# EAGLE design zSum_4_io_board_rev_A (EAGLE 6.5.0)
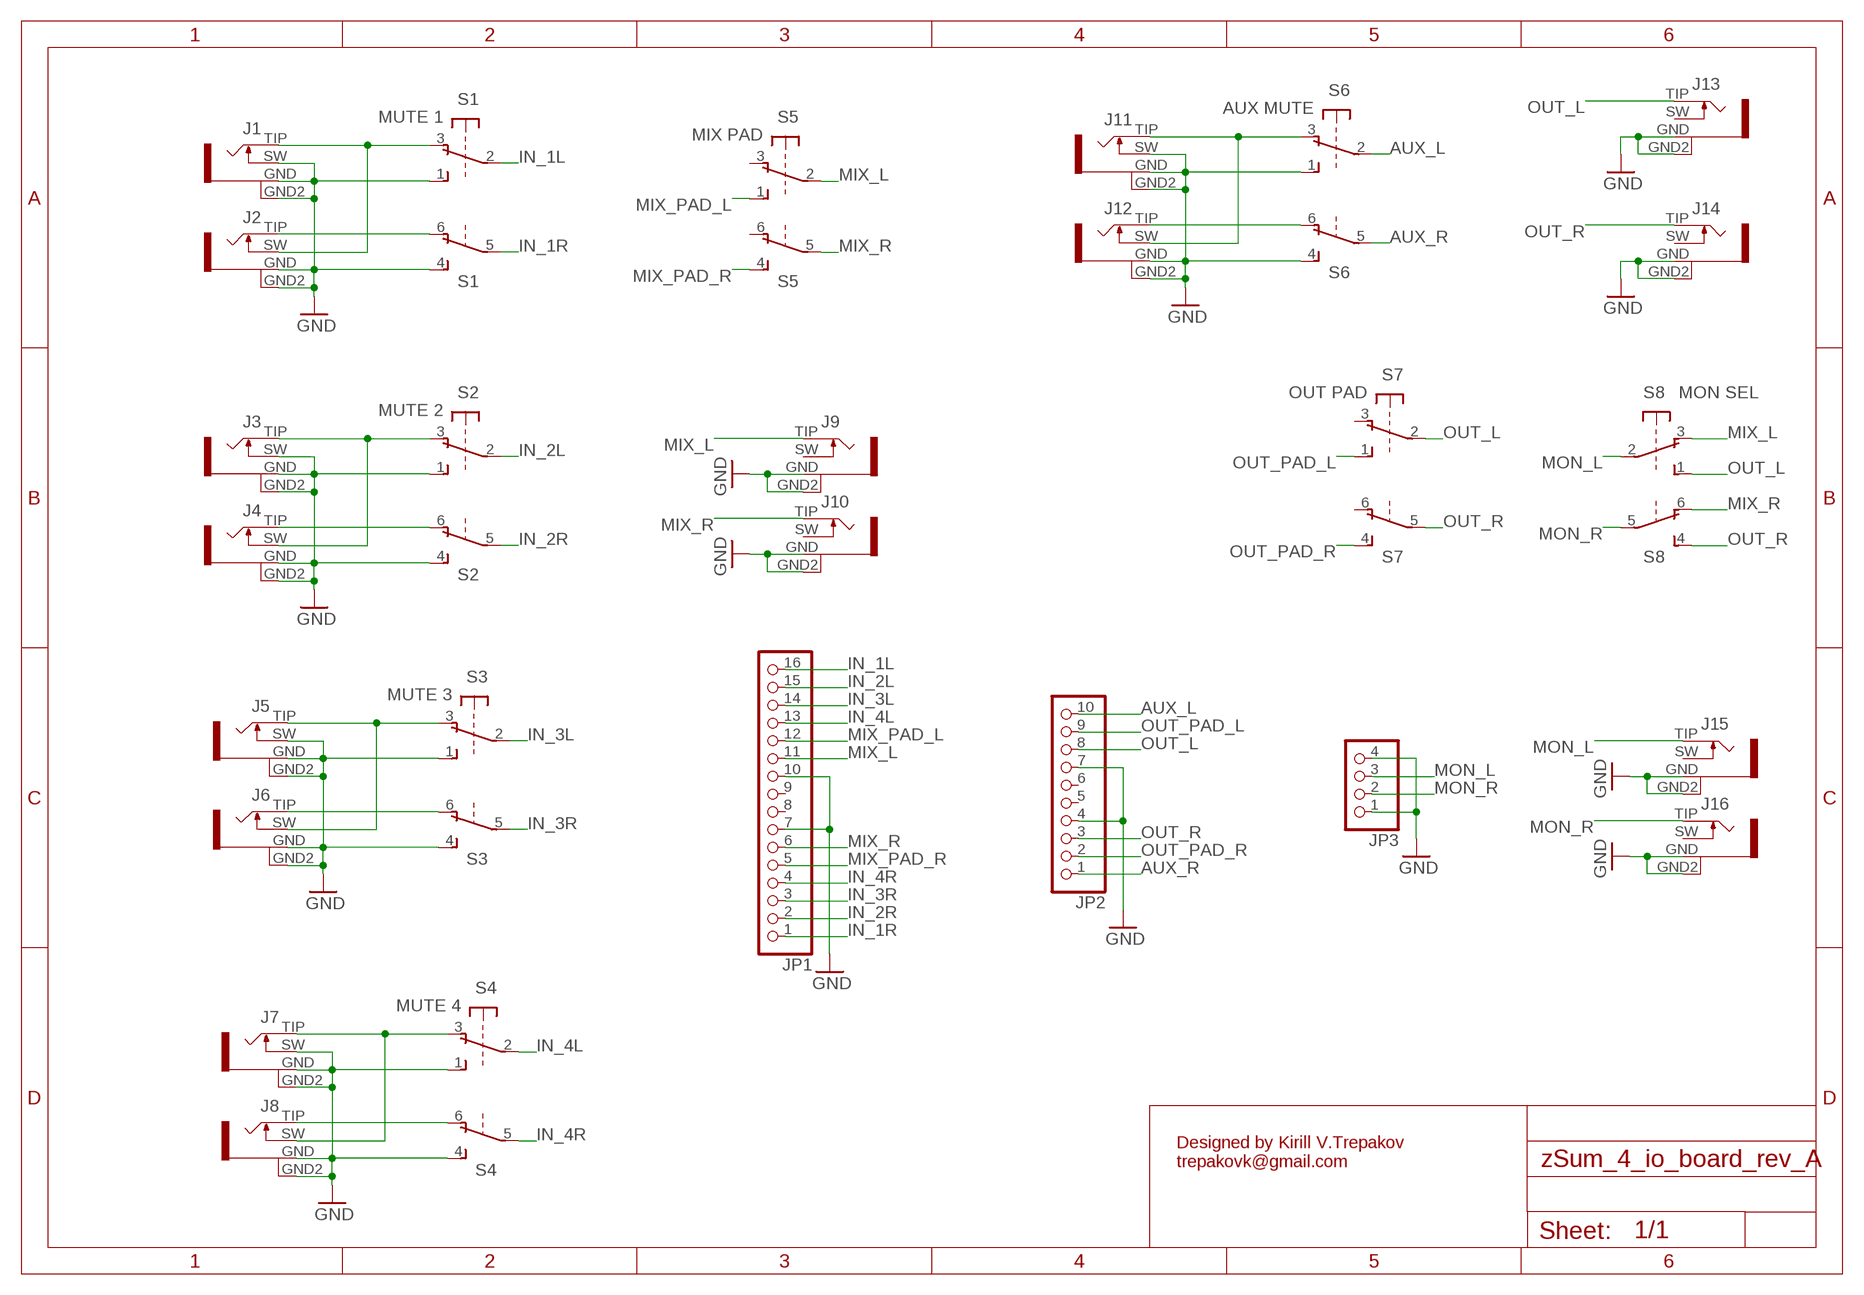
[diagram p0: schematic, sheet 1]

## Parts
J1  PJ301WQP  [WQP_PJ_301BM]
J2  PJ301WQP  [WQP_PJ_301BM]
J3  PJ301WQP  [WQP_PJ_301BM]
J4  PJ301WQP  [WQP_PJ_301BM]
J5  PJ301WQP  [WQP_PJ_301BM]
J6  PJ301WQP  [WQP_PJ_301BM]
J7  PJ301WQP  [WQP_PJ_301BM]
J8  PJ301WQP  [WQP_PJ_301BM]
J9  PJ301WQP  [WQP_PJ_301BM]
J10  PJ301WQP  [WQP_PJ_301BM]
J11  PJ301WQP  [WQP_PJ_301BM]
J12  PJ301WQP  [WQP_PJ_301BM]
J13  PJ301WQP  [WQP_PJ_301BM]
J14  PJ301WQP  [WQP_PJ_301BM]
J15  PJ301WQP  [WQP_PJ_301BM]
J16  PJ301WQP  [WQP_PJ_301BM]
JP1  PINHD-1X16  [1X16_]
JP2  PINHD-1X10  [1X10_]
JP3  PINHD-1X4  [1X04]
S1  MUTE 1  9077-2  [9077-2]
S2  MUTE 2  9077-2  [9077-2]
S3  MUTE 3  9077-2  [9077-2]
S4  MUTE 4  9077-2  [9077-2]
S5  MIX PAD  9077-2  [9077-2]
S6  AUX MUTE  9077-2  [9077-2]
S7  OUT PAD  9077-2  [9077-2]
S8  MON SEL  9077-2  [9077-2]

## Nets
AUX_L: JP2.10 S6.2(1:P)
AUX_R: JP2.1 S6.5(2:P)
GND: J1.GND J1.GND2 J1.SW J2.GND J2.GND2 J3.GND J3.GND2 J3.SW J4.GND J4.GND2 J5.GND J5.GND2 J5.SW J6.GND J6.GND2 J7.GND J7.GND2 J7.SW J8.GND J8.GND2 J9.GND J9.GND2 J10.GND J10.GND2 J11.GND J11.GND2 J11.SW J12.GND J12.GND2 J13.GND J13.GND2 J14.GND J14.GND2 J15.GND J15.GND2 J16.GND J16.GND2 JP1.7 JP1.10 JP2.4 JP2.7 JP3.1 JP3.4 S1.1(1:S) S1.4(2:S) S2.1(1:S) S2.4(2:S) S3.1(1:S) S3.4(2:S) S4.1(1:S) S4.4(2:S) S6.1(1:S) S6.4(2:S)
IN_1L: JP1.16 S1.2(1:P)
IN_1R: JP1.1 S1.5(2:P)
IN_2L: JP1.15 S2.2(1:P)
IN_2R: JP1.2 S2.5(2:P)
IN_3L: JP1.14 S3.2(1:P)
IN_3R: JP1.3 S3.5(2:P)
IN_4L: JP1.13 S4.2(1:P)
IN_4R: JP1.4 S4.5(2:P)
MIX_L: J9.TIP JP1.11 S5.2(1:P) S8.3(1:O)
MIX_PAD_L: JP1.12 S5.1(1:S)
MIX_PAD_R: JP1.5 S5.4(2:S)
MIX_R: J10.TIP JP1.6 S5.5(2:P) S8.6(2:O)
MON_L: J15.TIP JP3.3 S8.2(1:P)
MON_R: J16.TIP JP3.2 S8.5(2:P)
N$1: J1.TIP J2.SW S1.3(1:O)
N$5: J3.TIP J4.SW S2.3(1:O)
N$6: J2.TIP S1.6(2:O)
N$7: J4.TIP S2.6(2:O)
N$8: J5.TIP J6.SW S3.3(1:O)
N$9: J6.TIP S3.6(2:O)
N$10: J7.TIP J8.SW S4.3(1:O)
N$11: J8.TIP S4.6(2:O)
N$12: J11.TIP J12.SW S6.3(1:O)
N$13: J12.TIP S6.6(2:O)
OUT_L: J13.TIP JP2.8 S7.2(1:P) S8.1(1:S)
OUT_PAD_L: JP2.9 S7.1(1:S)
OUT_PAD_R: JP2.2 S7.4(2:S)
OUT_R: J14.TIP JP2.3 S7.5(2:P) S8.4(2:S)
Unconnected: J9.SW J10.SW J13.SW J14.SW J15.SW J16.SW JP1.8 JP1.9 JP2.5 JP2.6 S5.3(1:O) S5.6(2:O) S7.3(1:O) S7.6(2:O)

## Notes on the sheet
- Designed by Kirill V.Trepakov
  trepakovk@gmail.com

## Library data of the parts
J1-J16 = og-pj301:PJ301
JP1 = _mtvl.connectors:PINHD-1X16: PIN HEADER
JP2 = _mtvl.connectors:PINHD-1X10: PIN HEADER
JP3 = _mtvl.connectors:PINHD-1X4: PIN HEADER
S1-S8 = _zEROID:9077-2: MARQUARDT SWITCH 9077.0200 Distributor: Buerklin <https://www.buerklin.com/default.asp?event=ShowArtikel%2812G2822%29&l=d&jump=ArtNr_12G2822>

## Board
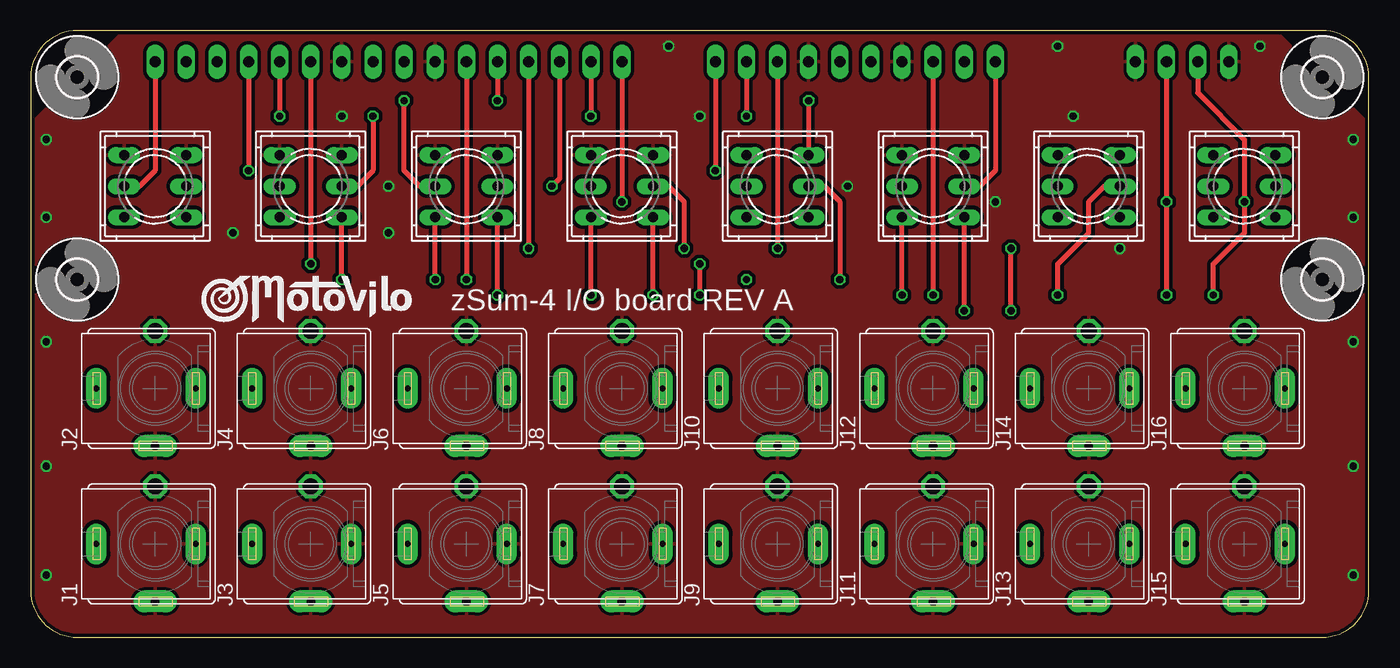
[diagram p1: board, top side]
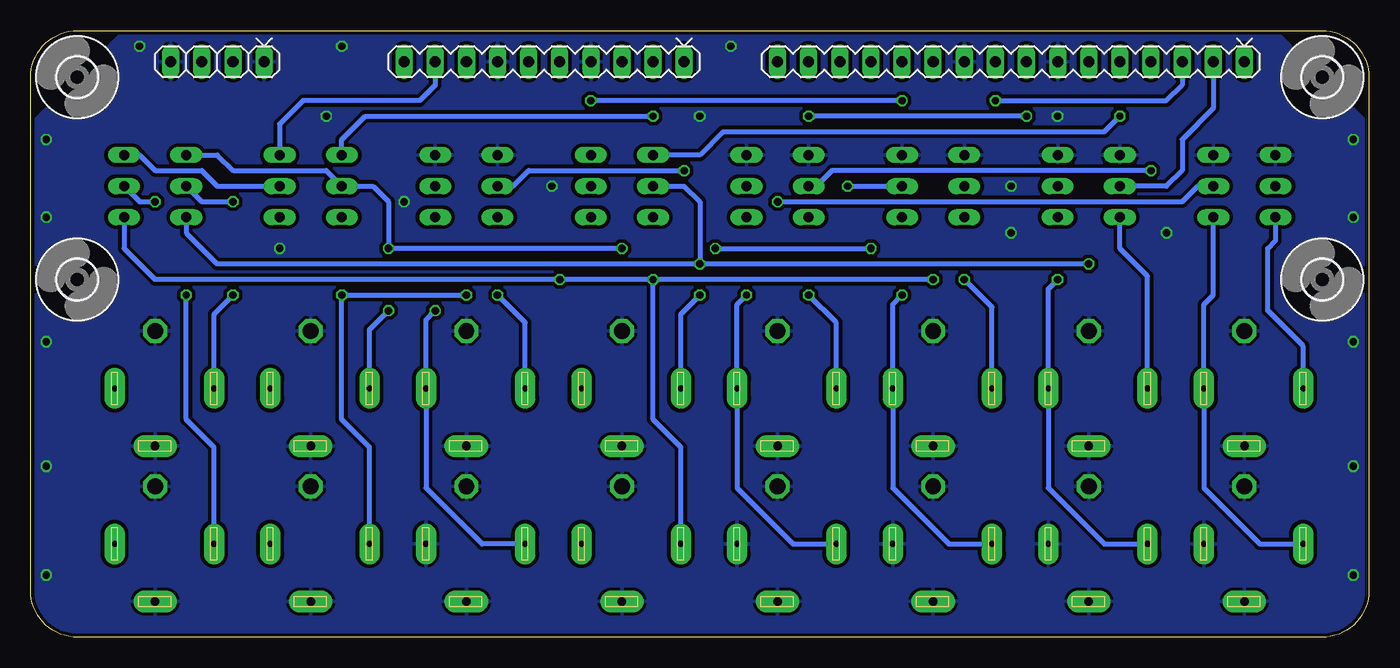
[diagram p2: board, bottom side, seen from below]

Size 109.22 x 49.53 mm. Coordinates in mm from the lower left corner, seen from the top.
Outline: 3.81,0 105.41,0 arc90 109.22,3.81 109.22,45.72 arc90 105.41,49.53 3.81,49.53 arc90 0,45.72 0,3.81 arc90 3.81,0
Copper layers (1*16): Top 0.035mm / dielectric 1.5mm / Bottom 0.035mm
Design rules "ITEADstudio_DRC_z": minimum track width 10mil, minimum drill 12mil, track to track 10mil, track to pad 10mil, pad to pad 10mil, via to via 10mil, smd to smd 8mil, copper to edge 10mil, drill to drill 25mil, minimum pad ring 10mil, minimum via ring 6mil, stop-mask expansion 2mil, vias tented up to drill 100mil, thermal gap 10mil

### Footprints (pad centres in the part's own frame; a part is rotated, then mirrored left to right if it is on the bottom)
WQP_PJ_301BM = drill 0.7 pad 1.778 long: GND -4.7,0 | drill 1.3 octagon: GND2 4.7,0 | drill 0.5 pad 1.676 long: SW 0,-3.3; TIP 0,4.8
1X16_ = drill 0.9 long: 1 -19.05,0; 2 -16.51,0; 3 -13.97,0; 4 -11.43,0; 5 -8.89,0; 6 -6.35,0; 7 -3.81,0; 8 -1.27,0; 9 1.27,0; 10 3.81,0; 11 6.35,0; 12 8.89,0; 13 11.43,0; 14 13.97,0; 15 16.51,0; 16 19.05,0
1X10_ = drill 0.9 long: 1 -11.43,0; 2 -8.89,0; 3 -6.35,0; 4 -3.81,0; 5 -1.27,0; 6 1.27,0; 7 3.81,0; 8 6.35,0; 9 8.89,0; 10 11.43,0
1X04 = drill 0.9 long: 1 -3.81,0; 2 -1.27,0; 3 1.27,0; 4 3.81,0
9077-2 = drill 0.813 long: 1 -2.54,2.54; 2 0,2.54; 3 2.54,2.54; 4 -2.54,-2.54; 5 0,-2.54; 6 2.54,-2.54
3,2_NEW = hole 3.2: 0,0

### Placement (x,y rotation side)
J1  10.16,7.62 90 top
J2  10.16,20.32 90 top
J3  22.86,7.62 90 top
J4  22.86,20.32 90 top
J5  35.56,7.62 90 top
J6  35.56,20.32 90 top
J7  48.26,7.62 90 top
J8  48.26,20.32 90 top
J9  60.96,7.62 90 top
J10  60.96,20.32 90 top
J11  73.66,7.62 90 top
J12  73.66,20.32 90 top
J13  86.36,7.62 90 top
J14  86.36,20.32 90 top
J15  99.06,7.62 90 top
J16  99.06,20.32 90 top
JP1  29.21,46.99 180 bottom
JP2  67.31,46.99 180 bottom
JP3  93.98,46.99 180 bottom
S1  10.16,36.83 270 top
S2  22.86,36.83 270 top
S3  35.56,36.83 270 top
S4  48.26,36.83 270 top
S5  60.96,36.83 270 top
S6  73.66,36.83 270 top
S7  86.36,36.83 270 top
S8  99.06,36.83 270 top
U$1  [3,2_NEW]  3.81,45.72 0 top
U$2  [3,2_NEW]  105.41,45.72 0 top
U$3  [3,2_NEW]  3.81,29.21 0 top
U$4  [3,2_NEW]  105.41,29.21 0 top
U$6  [LOGO_SPACE_002]  13.97,25.72 0 top

### Tracks (layer width: path | path; a pad name or v marks a point on that pad's centre or on a via)
AUX_L
  Top 0.406: JP2.10 78.74,38.1 77.47,36.83 S6.2
AUX_R  (via drill 0.6)
  Top 0.406: JP2.1 v55.88,38.1
  Bottom 0.406: S6.5 69.85,36.83 68.58,38.1 v55.88,38.1
GND  (via drill 0.6)
  other vias: 107.95,40.64 107.95,34.29 1.27,40.64 1.27,34.29 29.21,33.02 52.07,48.26 83.82,48.26 1.27,24.13 107.95,24.13 1.27,13.97 1.27,5.08 107.95,13.97 107.95,5.08 100.33,48.26 16.51,33.02 66.67,36.83 78.74,35.56 85.09,42.55 54.61,42.55 25.4,42.55 29.21,36.83 88.9,31.75
  pour Top (isolate 0.305): 0,41.91 7.62,49.53 101.6,49.53 109.22,41.91 109.22,0 0,0
  pour Bottom (isolate 0.305): 0,0 0,41.91 7.62,49.53 101.6,49.53 109.22,41.91 109.22,0
IN_1L  (via drill 0.6)
  Top 0.406: JP1.16 v48.26,35.56
  Bottom 0.406: v48.26,35.56 15.24,35.56 13.97,36.83 S1.2
IN_1R
  Top 0.406: S1.5 8.89,36.83 10.16,38.1 JP1.1
IN_2L  (via drill 0.6)
  Top 0.406: v27.94,42.55 27.94,38.1 26.67,36.83 S2.2 | JP1.15 v45.72,42.55
  Bottom 0.406: v27.94,42.55 v45.72,42.55
IN_2R
  Bottom 0.406: JP1.2 12.7,43.18 15.24,40.64 15.24,38.1 16.51,36.83 S2.5
IN_3L  (via drill 0.6)
  Top 0.406: JP1.14 43.18,37.47 v42.55,36.83
  Bottom 0.406: v42.55,36.83 S3.2
IN_3R  (via drill 0.6)
  Top 0.406: S3.5 31.75,36.83 30.48,38.1 v30.48,43.81
  Bottom 0.406: v30.48,43.81 16.51,43.81 15.24,45.09 JP1.3
IN_4L  (via drill 0.6)
  Top 0.406: v53.34,31.75 53.34,35.56 52.07,36.83 S4.2 | JP1.13 v40.64,31.75
  Bottom 0.406: v53.34,31.75 v40.64,31.75
IN_4R  (via drill 0.6)
  Top 0.406: JP1.4 v17.78,38.1
  Bottom 0.406: v17.78,38.1 43.81,38.1 45.09,36.83 S4.5
MIX_L  (via drill 0.6)
  Top 0.406: S5.2 64.77,36.83 66.04,35.56 v66.04,29.21 | JP1.11 v35.56,29.21
  Bottom 0.406: v35.56,29.21 v58.42,29.21 | v58.42,29.21 v66.04,29.21 99.06,29.21 101.6,31.75 S8.3 | v58.42,29.21 58.42,17.78 56.16,15.52 J9.TIP
MIX_PAD_L  (via drill 0.6)
  Top 0.406: JP1.12 v38.1,43.81 | v63.5,43.81 S5.1
  Bottom 0.406: v38.1,43.81 v63.5,43.81
MIX_PAD_R  (via drill 0.6)
  Top 0.406: JP1.5 v20.32,42.55
  Bottom 0.406: S5.4 54.61,39.37 52.7,41.27 21.59,41.27 v20.32,42.55
MIX_R  (via drill 0.6)
  Top 0.406: JP1.6 v22.86,30.48 | v54.61,27.94 v54.61,30.48
  Bottom 0.406: v22.86,30.48 v54.61,30.48 | v54.61,30.48 93.98,30.48 96.52,33.02 S8.6 | S5.5 55.88,36.83 54.61,35.56 v54.61,30.48 | J10.TIP 56.16,26.39 v54.61,27.94
MON_L  (via drill 0.6)
  Top 0.406: v96.52,27.94 96.52,30.48 99.06,33.02 v99.06,35.56 99.06,40.64 95.25,44.45 JP3.3
  Bottom 0.406: J15.TIP 94.26,15.52 96.52,17.78 v96.52,27.94 | S8.2 100.33,35.56 v99.06,35.56
MON_R  (via drill 0.6)
  Top 0.406: JP3.2 v92.71,35.56 v92.71,27.94
  Bottom 0.406: S8.5 95.25,35.56 v92.71,35.56 | J16.TIP 94.26,26.39 v92.71,27.94
N$1
  Bottom 0.406: S1.3 12.7,27.94 13.46,27.18 J2.SW 13.46,12.19 8.89,7.62 J1.TIP
N$5  (via drill 0.6)
  Top 0.406: v25.4,29.21 S2.3
  Bottom 0.406: J3.TIP 21.59,7.62 26.16,12.19 J4.SW 26.16,28.45 v25.4,29.21
N$6
  Bottom 0.406: S1.6 7.62,32.38 8.26,31.75 8.26,26.67 5.36,23.77 J2.TIP
N$7
  Bottom 0.406: J4.TIP 18.06,29.49 20.32,31.75 S2.6
N$8  (via drill 0.6)
  Top 0.406: v38.1,27.94 S3.3
  Bottom 0.406: J5.TIP 34.29,7.62 38.86,12.19 J6.SW 38.86,27.18 v38.1,27.94
N$9  (via drill 0.6)
  Top 0.406: v33.02,29.21 S3.6
  Bottom 0.406: J6.TIP 30.76,26.95 v33.02,29.21
N$10  (via drill 0.6)
  Top 0.406: v50.8,27.94 S4.3
  Bottom 0.406: J7.TIP 46.99,7.62 51.56,12.19 J8.SW 51.56,27.18 v50.8,27.94
N$11  (via drill 0.6)
  Top 0.406: v45.72,27.94 S4.6
  Bottom 0.406: J8.TIP 43.46,25.68 v45.72,27.94
N$12  (via drill 0.6)
  Top 0.406: v76.2,26.67 S6.3
  Bottom 0.406: J11.TIP 72.39,7.62 76.96,12.19 J12.SW 76.96,25.91 v76.2,26.67
N$13  (via drill 0.6)
  Top 0.406: v71.12,27.94 S6.6
  Bottom 0.406: J12.TIP 68.86,25.68 v71.12,27.94
OUT_L  (via drill 0.6)
  Top 0.406: JP2.8 v73.66,27.94 | S7.2 87.63,36.83 86.36,35.56 86.36,33.02 83.82,30.48 v83.82,27.94
  Bottom 0.406: J13.TIP 81.56,15.52 83.82,17.78 v83.82,27.94 v73.66,27.94 | S8.1 100.33,39.37 99.06,38.1 95.25,38.1 93.98,36.83 S7.2
OUT_PAD_L
  Bottom 0.406: JP2.9 76.2,45.09 77.47,43.81 87,43.81 88.9,41.91 S7.1
OUT_PAD_R  (via drill 0.6)
  Top 0.406: JP2.2 v58.42,42.55
  Bottom 0.406: S7.4 83.82,40.64 81.92,42.55 v58.42,42.55
OUT_R  (via drill 0.6)
  Top 0.406: JP2.3 v60.96,31.75 | v80.01,26.67 v80.01,31.75
  Bottom 0.406: S8.4 93.98,39.37 92.71,38.1 85.09,38.1 S7.5 81.28,36.83 80.01,35.56 v80.01,31.75 v60.96,31.75 | J14.TIP 81.56,25.12 v80.01,26.67

### Text on the board
tPlace: zSum-4 I/O board REV A